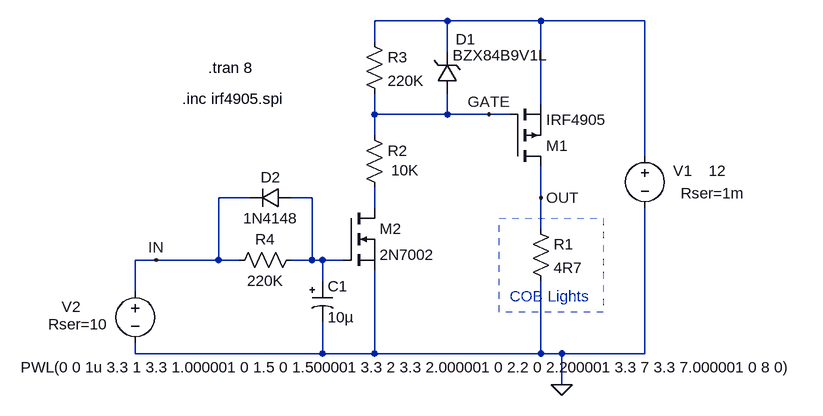
[diagram p0: schematic PChan-Mosfet-driver-redesigned.asc]
PChan-Mosfet-driver-redesigned.asc, the LTspice schematic file:
Version 4
SHEET 1 964 680
WIRE 416 -32 304 -32
WIRE 560 -32 416 -32
WIRE 720 -32 560 -32
WIRE 304 0 304 -32
WIRE 416 16 416 -32
WIRE 560 96 560 -32
WIRE 304 112 304 80
WIRE 416 112 416 80
WIRE 416 112 304 112
WIRE 480 112 416 112
WIRE 512 112 480 112
WIRE 304 144 304 112
WIRE 720 176 720 -32
WIRE 112 240 64 240
WIRE 208 240 176 240
WIRE 560 240 560 192
WIRE 304 256 304 224
WIRE 560 288 560 240
WIRE -32 336 -64 336
WIRE 64 336 64 240
WIRE 64 336 -32 336
WIRE 96 336 64 336
WIRE 208 336 208 240
WIRE 208 336 176 336
WIRE 224 336 208 336
WIRE 256 336 224 336
WIRE 224 368 224 336
WIRE -64 384 -64 336
WIRE -64 480 -64 464
WIRE 224 480 224 432
WIRE 224 480 -64 480
WIRE 304 480 304 352
WIRE 304 480 224 480
WIRE 560 480 560 368
WIRE 560 480 304 480
WIRE 592 480 560 480
WIRE 720 480 720 256
WIRE 720 480 592 480
WIRE 592 528 592 480
FLAG 592 528 0
FLAG -32 336 IN
FLAG 480 112 GATE
FLAG 560 240 OUT
SYMBOL res 544 272 R0
SYMATTR InstName R1
SYMATTR Value 4R7
SYMBOL res 288 128 R0
WINDOW 3 42 70 Left 2
SYMATTR Value 10K
SYMATTR InstName R2
SYMBOL nmos 256 256 R0
SYMATTR InstName M2
SYMATTR Value 2N7002
SYMBOL voltage 720 160 M0
WINDOW 123 0 0 Left 0
WINDOW 39 -154 73 Left 2
WINDOW 0 -73 39 Left 2
WINDOW 3 -125 39 Left 2
SYMATTR SpiceLine Rser=1m
SYMATTR InstName V1
SYMATTR Value 12
SYMBOL voltage -64 368 M0
WINDOW 123 0 0 Left 0
WINDOW 39 42 67 Left 2
WINDOW 0 84 40 Left 2
WINDOW 3 -1026 133 Left 2
SYMATTR SpiceLine Rser=10
SYMATTR InstName V2
SYMATTR Value PWL(0 0 1u 3.3 1 3.3 1.000001 0 1.5 0 1.500001 3.3 2 3.3 2.000001 0 2.2 0 2.200001 3.3 7 3.3 7.000001 0 8 0)
SYMBOL res 288 -16 R0
SYMATTR InstName R3
SYMATTR Value 220K
SYMBOL pmos 512 192 M180
SYMATTR InstName M1
SYMATTR Value IRF4905
SYMATTR Prefix X
SYMBOL zener 400 80 M180
WINDOW 0 29 84 Left 2
WINDOW 3 24 59 Left 2
SYMATTR InstName D1
SYMATTR Value BZX84B9V1L
SYMATTR Description Diode
SYMATTR Type diode
SYMBOL res 192 320 R90
WINDOW 0 0 56 VBottom 2
WINDOW 3 32 56 VTop 2
SYMATTR InstName R4
SYMATTR Value 220K
SYMBOL diode 176 224 R90
WINDOW 0 0 32 VBottom 2
WINDOW 3 32 32 VTop 2
SYMATTR InstName D2
SYMATTR Value 1N4148
SYMBOL polcap 208 368 R0
WINDOW 3 24 56 Left 2
SYMATTR Value 10µ
SYMATTR InstName C1
SYMATTR Description Capacitor
SYMATTR Type cap
SYMATTR SpiceLine V=10 Irms=2.21565 Rser=0.055 Lser=0 mfg="KEMET" pn="A700V106M010ATE055" type="Al electrolytic"
TEXT 8 88 Left 2 !.inc irf4905.spi
TEXT 48 40 Left 2 !.tran 8
TEXT 512 392 Left 2 ;COB Lights
RECTANGLE Normal 656 416 496 272 2

The netlist it stands for:
* PChan-Mosfet-driver-redesigned.asc
R1 OUT 0 4R7
R2 GATE N003 10K
M2 N003 N002 0 0 2N7002
V1 N001 0 12 Rser=1m
V2 IN 0 PWL(0 0 1u 3.3 1 3.3 1.000001 0 1.5 0 1.500001 3.3 2 3.3 2.000001 0 2.2 0 2.200001 3.3 7 3.3 7.000001 0 8 0) Rser=10
R3 N001 GATE 220K
XM1 OUT GATE N001 IRF4905  ; pins D G S
D1 GATE N001 BZX84B9V1L
R4 N002 IN 220K
D2 N002 IN 1N4148
C1 N002 0 10µ V=10 Irms=2.21565 Rser=0.055 Lser=0 mfg="KEMET" pn="A700V106M010ATE055" type="Al electrolytic"
.model D D
.lib standard.dio
.model NMOS NMOS
.model PMOS PMOS
.lib standard.mos
.inc irf4905.spi
.tran 8
* COB Lights
.backanno
.end